# Altium schematic sheet CarettaCellModule.SchDoc
size A
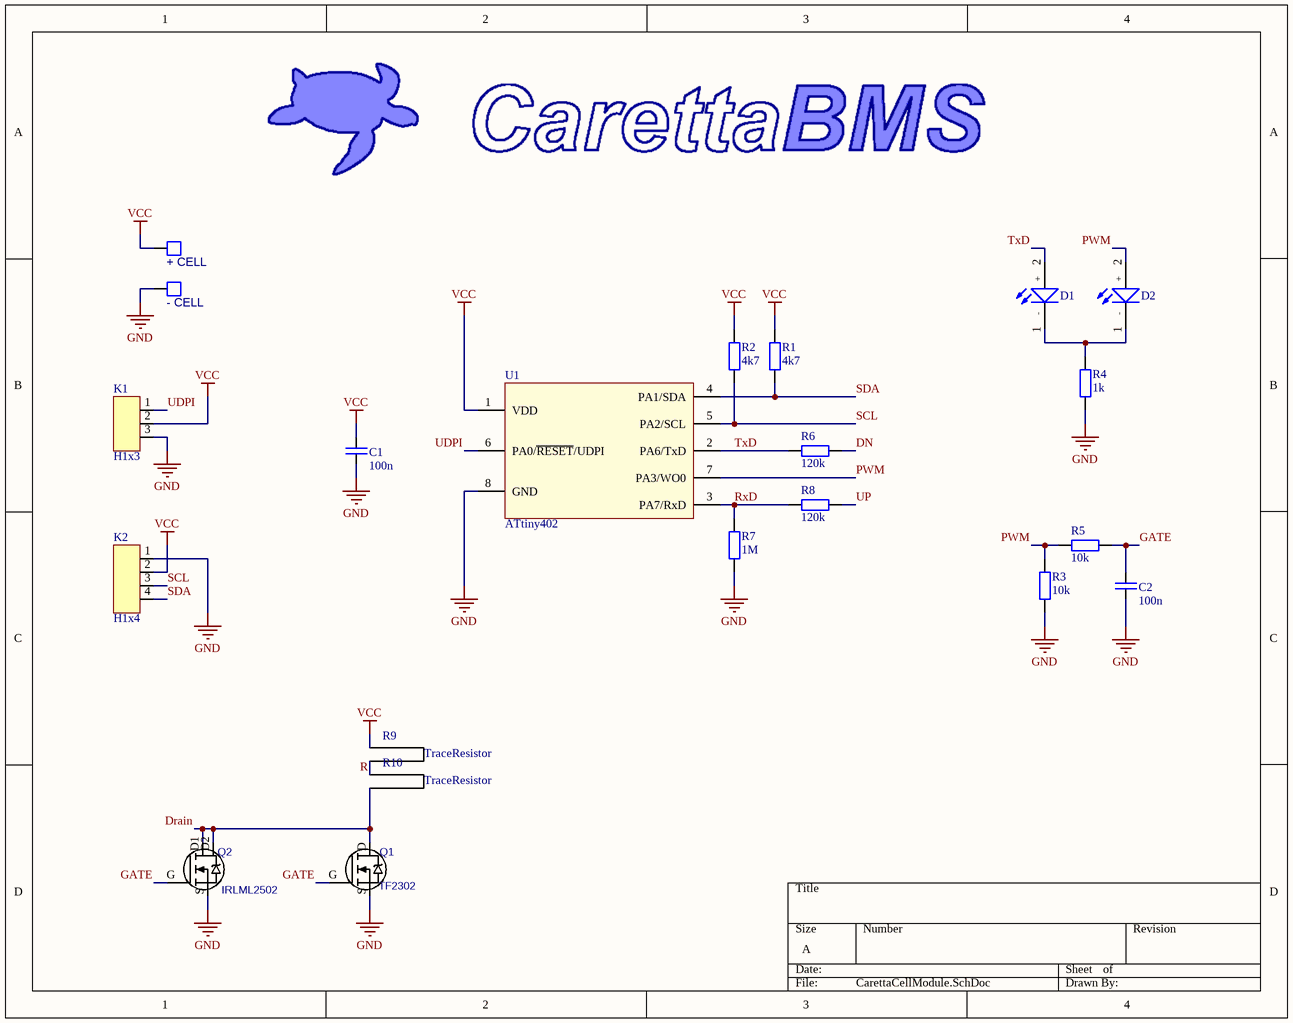
[diagram p0: CarettaCellModule.SchDoc]

## Parts
+_CELL  PAD  [PAD]  (value not drawn)
-_CELL  PAD  [PAD]  (value not drawn)
C1  100n  [C1608_0603I_N]
C2  100n  [C1608_0603I_N]
D1  LED  [LED1608_0603I_N]  (value not drawn)
D2  LED  [LED1608_0603I_N]  (value not drawn)
K1  H1x3  [H1x3]
K2  H1x4  [H1x4]
Q1  TF2302  [SOT23-3_N]
Q2  IRLML2502  [SOT223_L]
R1  4k7  [R1608_0603I_N]
R2  4k7  [R1608_0603I_N]
R3  10k  [R1608_0603I_N]
R4  1k  [R1608_0603I_N]
R5  10k  [R1608_0603I_N]
R6  120k  [R1608_0603I_N]
R7  1M  [R1608_0603I_N]
R8  120k  [R1608_0603I_N]
R9  TraceResistor  [NetTie]  (net tie, no BOM)
R10  TraceResistor  [NetTie]  (net tie, no BOM)
U1  ATtiny402  [ATtiny402-SSFR]

## Nets
GND: -_CELL.1 C1.2 C2.2 K1.3 K2.1 Q1.S Q2.S R3.2 R4.2 R7.2 U1.8(GND)
VCC: +_CELL.1 C1.1 K1.2 K2.2 R1.1 R2.1 R9.1 U1.1(VDD)
DN: R6.2
Drain: Q1.D Q2.D1(D) Q2.D2(D) R10.2
GATE: C2.1 Q1.G Q2.G R5.2
PWM: D2.2(+) R3.1 R5.1 U1.7(PA3/WO0)
R: R9.2 R10.1
RxD: R7.1 R8.1 U1.3(PA7/RxD)
SCL: K2.3 R2.2 U1.5(PA2/SCL)
SDA: K2.4 R1.2 U1.4(PA1/SDA)
TxD: D1.2(+) R6.1 U1.2(PA6/TxD)
UDPI: K1.1 U1.6(PA0/~{RESET}/UDPI)
UP: R8.2
NetD1_1: D1.1(-) D2.1(-) R4.1

## Library data of the parts
C1 C2 = C: Capacitor
K1 = H1x3: Header 1x3 (male)
K2 = H1x4: Header 1x4 (male)
Q1 = 2N7002: N-ch, Vdss=60V, Id=115mA, Rdson=2R; pin to pad: D>3 G>1 S>2; Value: {Value}
Q2 = BSP603S2L: pin to pad: D1>4 D2>2 G>1 S>3; Value: {Value}
R1-R8 = R